# Altium schematic sheet mappower.SchDoc
size A4; SheetNumber: 3; SheetTotal: 3
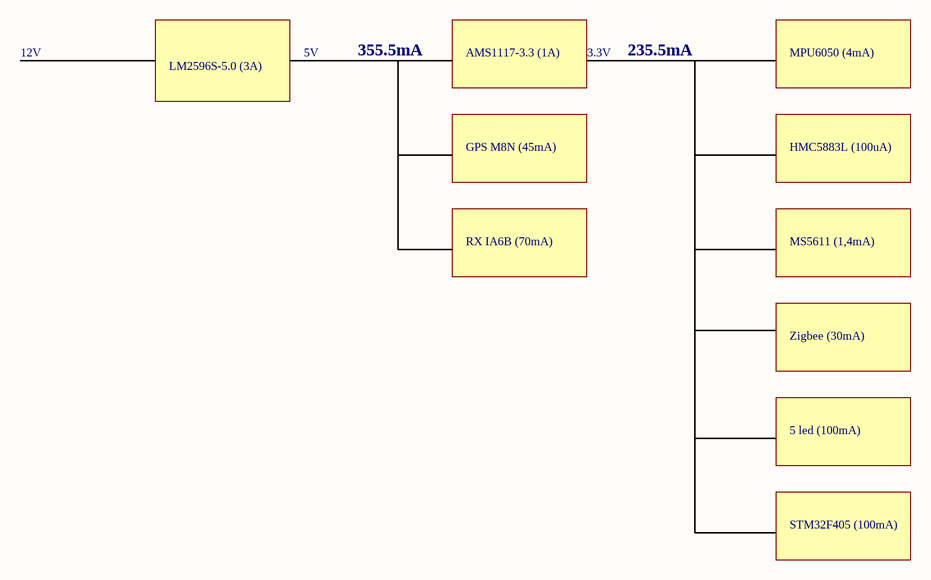
[diagram p0: mappower.SchDoc]

## Notes on the sheet
- 12V
- LM2596S-5.0 (3A)
- 5V
- 355.5mA
- AMS1117-3.3 (1A)
- 3.3V
- 235.5mA
- MPU6050 (4mA)
- GPS M8N (45mA)
- HMC5883L (100uA)
- RX IA6B (70mA)
- MS5611 (1,4mA)
- Zigbee (30mA)
- 5 led (100mA)
- STM32F405 (100mA)